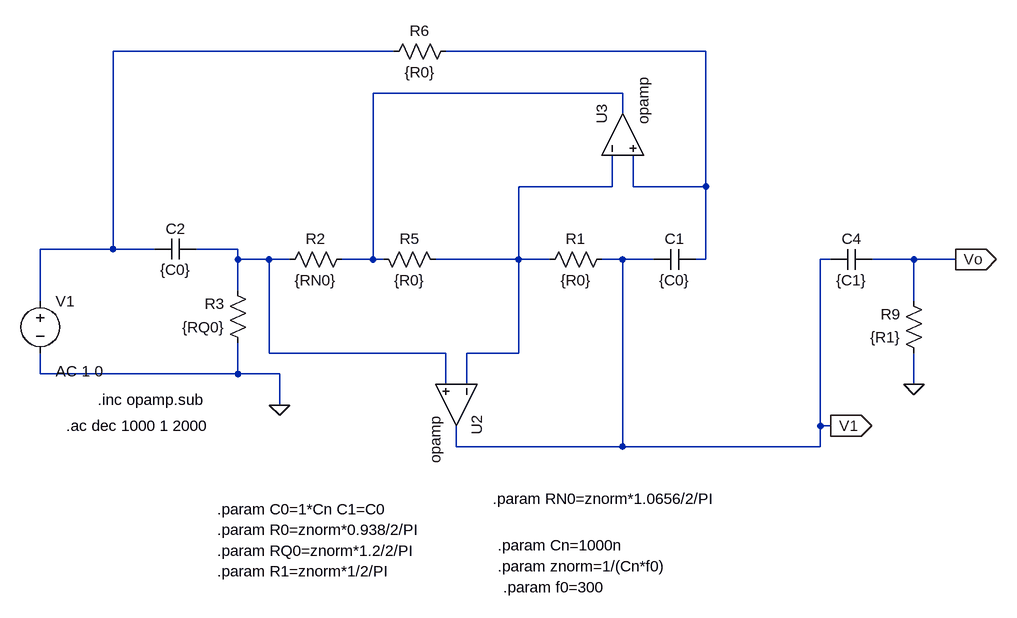
[diagram p0: schematic TS6_gic_final.asc]
TS6_gic_final.asc, the LTspice schematic file:
Version 4
SHEET 1 1976 1044
WIRE 400 64 -32 64
WIRE 880 64 480 64
WIRE 752 128 368 128
WIRE 752 160 752 128
WIRE 736 272 736 224
WIRE 736 272 592 272
WIRE 768 272 768 224
WIRE 880 272 880 64
WIRE 880 272 768 272
WIRE -32 368 -32 64
WIRE -32 368 -144 368
WIRE 32 368 -32 368
WIRE 160 368 96 368
WIRE 160 384 160 368
WIRE 208 384 160 384
WIRE 240 384 208 384
WIRE 368 384 368 128
WIRE 368 384 320 384
WIRE 384 384 368 384
WIRE 592 384 592 272
WIRE 592 384 464 384
WIRE 640 384 592 384
WIRE 752 384 720 384
WIRE 800 384 752 384
WIRE 880 384 880 272
WIRE 880 384 864 384
WIRE 1072 384 1056 384
WIRE 1200 384 1136 384
WIRE 1264 384 1200 384
WIRE 160 432 160 384
WIRE -144 448 -144 368
WIRE 1200 448 1200 384
WIRE 208 528 208 384
WIRE 480 528 208 528
WIRE 592 528 592 384
WIRE 592 528 512 528
WIRE -144 560 -144 528
WIRE 160 560 160 512
WIRE 160 560 -144 560
WIRE 224 560 160 560
WIRE 480 576 480 528
WIRE 512 576 512 528
WIRE 1200 576 1200 528
WIRE 224 608 224 560
WIRE 1056 640 1056 384
WIRE 1072 640 1056 640
WIRE 496 672 496 640
WIRE 752 672 752 384
WIRE 752 672 496 672
WIRE 1056 672 1056 640
WIRE 1056 672 752 672
FLAG 224 608 0
FLAG 1264 384 Vo
IOPIN 1264 384 Out
FLAG 1200 576 0
FLAG 1072 640 V1
IOPIN 1072 640 Out
SYMBOL voltage -144 432 R0
WINDOW 123 24 124 Left 2
WINDOW 39 0 0 Left 0
SYMATTR Value2 AC 1 0
SYMATTR InstName V1
SYMATTR Value ""
SYMBOL res 368 368 M90
WINDOW 0 0 56 VBottom 2
WINDOW 3 32 56 VTop 2
SYMATTR InstName R5
SYMATTR Value {R0}
SYMBOL Opamps/opamp 560 608 R90
SYMATTR InstName U2
SYMBOL Opamps/opamp 688 192 R270
SYMATTR InstName U3
SYMBOL res 624 400 R270
WINDOW 0 32 56 VTop 2
WINDOW 3 0 56 VBottom 2
SYMATTR InstName R1
SYMATTR Value {R0}
SYMBOL cap 864 368 R90
WINDOW 0 0 32 VBottom 2
WINDOW 3 32 32 VTop 2
SYMATTR InstName C1
SYMATTR Value {C0}
SYMBOL res 336 368 R90
WINDOW 0 0 56 VBottom 2
WINDOW 3 32 56 VTop 2
SYMATTR InstName R2
SYMATTR Value {RN0}
SYMBOL res 176 528 R180
WINDOW 0 36 76 Left 2
WINDOW 3 36 40 Left 2
SYMATTR InstName R3
SYMATTR Value {RQ0}
SYMBOL cap 96 352 R90
WINDOW 0 0 32 VBottom 2
WINDOW 3 32 32 VTop 2
SYMATTR InstName C2
SYMATTR Value {C0}
SYMBOL res 496 48 R90
WINDOW 0 0 56 VBottom 2
WINDOW 3 32 56 VTop 2
SYMATTR InstName R6
SYMATTR Value {R0}
SYMBOL res 1216 544 R180
WINDOW 0 36 76 Left 2
WINDOW 3 36 40 Left 2
SYMATTR InstName R9
SYMATTR Value {R1}
SYMBOL cap 1136 368 R90
WINDOW 0 0 32 VBottom 2
WINDOW 3 32 32 VTop 2
SYMATTR InstName C4
SYMATTR Value {C1}
TEXT -104 640 Left 2 !.ac dec 1000 1 2000
TEXT -56 600 Left 2 !.inc opamp.sub
TEXT 128 768 Left 2 !.param C0=1*Cn C1=C0
TEXT 128 800 Left 2 !.param R0=znorm*0.938/2/PI
TEXT 552 752 Left 2 !.param RN0=znorm*1.0656/2/PI
TEXT 128 832 Left 2 !.param RQ0=znorm*1.2/2/PI
TEXT 128 864 Left 2 !.param R1=znorm*1/2/PI
TEXT 560 824 Left 2 !.param Cn=1000n
TEXT 560 856 Left 2 !.param znorm=1/(Cn*f0)
TEXT 568 888 Left 2 !.param f0=300

The netlist it stands for:
* TS6_gic_final.asc
V1 N001 0 AC 1 0
R5 N003 N004 {R0}
XU2 N004 N005 V1 opamp Aol=100K GBW=10Meg  ; pins invin noninvin out
XU3 N004 N002 N003 opamp Aol=100K GBW=10Meg  ; pins invin noninvin out
R1 N004 V1 {R0}
C1 N002 V1 {C0}
R2 N003 N005 {RN0}
R3 0 N005 {RQ0}
C2 N005 N001 {C0}
R6 N002 N001 {R0}
R9 0 Vo {R1}
C4 Vo V1 {C1}
.ac dec 1000 1 2000
.inc opamp.sub
.param C0=1*Cn C1=C0
.param R0=znorm*0.938/2/PI
.param RN0=znorm*1.0656/2/PI
.param RQ0=znorm*1.2/2/PI
.param R1=znorm*1/2/PI
.param Cn=1000n
.param znorm=1/(Cn*f0)
.param f0=300
.backanno
.end